# EAGLE design tx-qo100-v3 (EAGLE 9.6.2)
Assembly variants: LOW_PWR
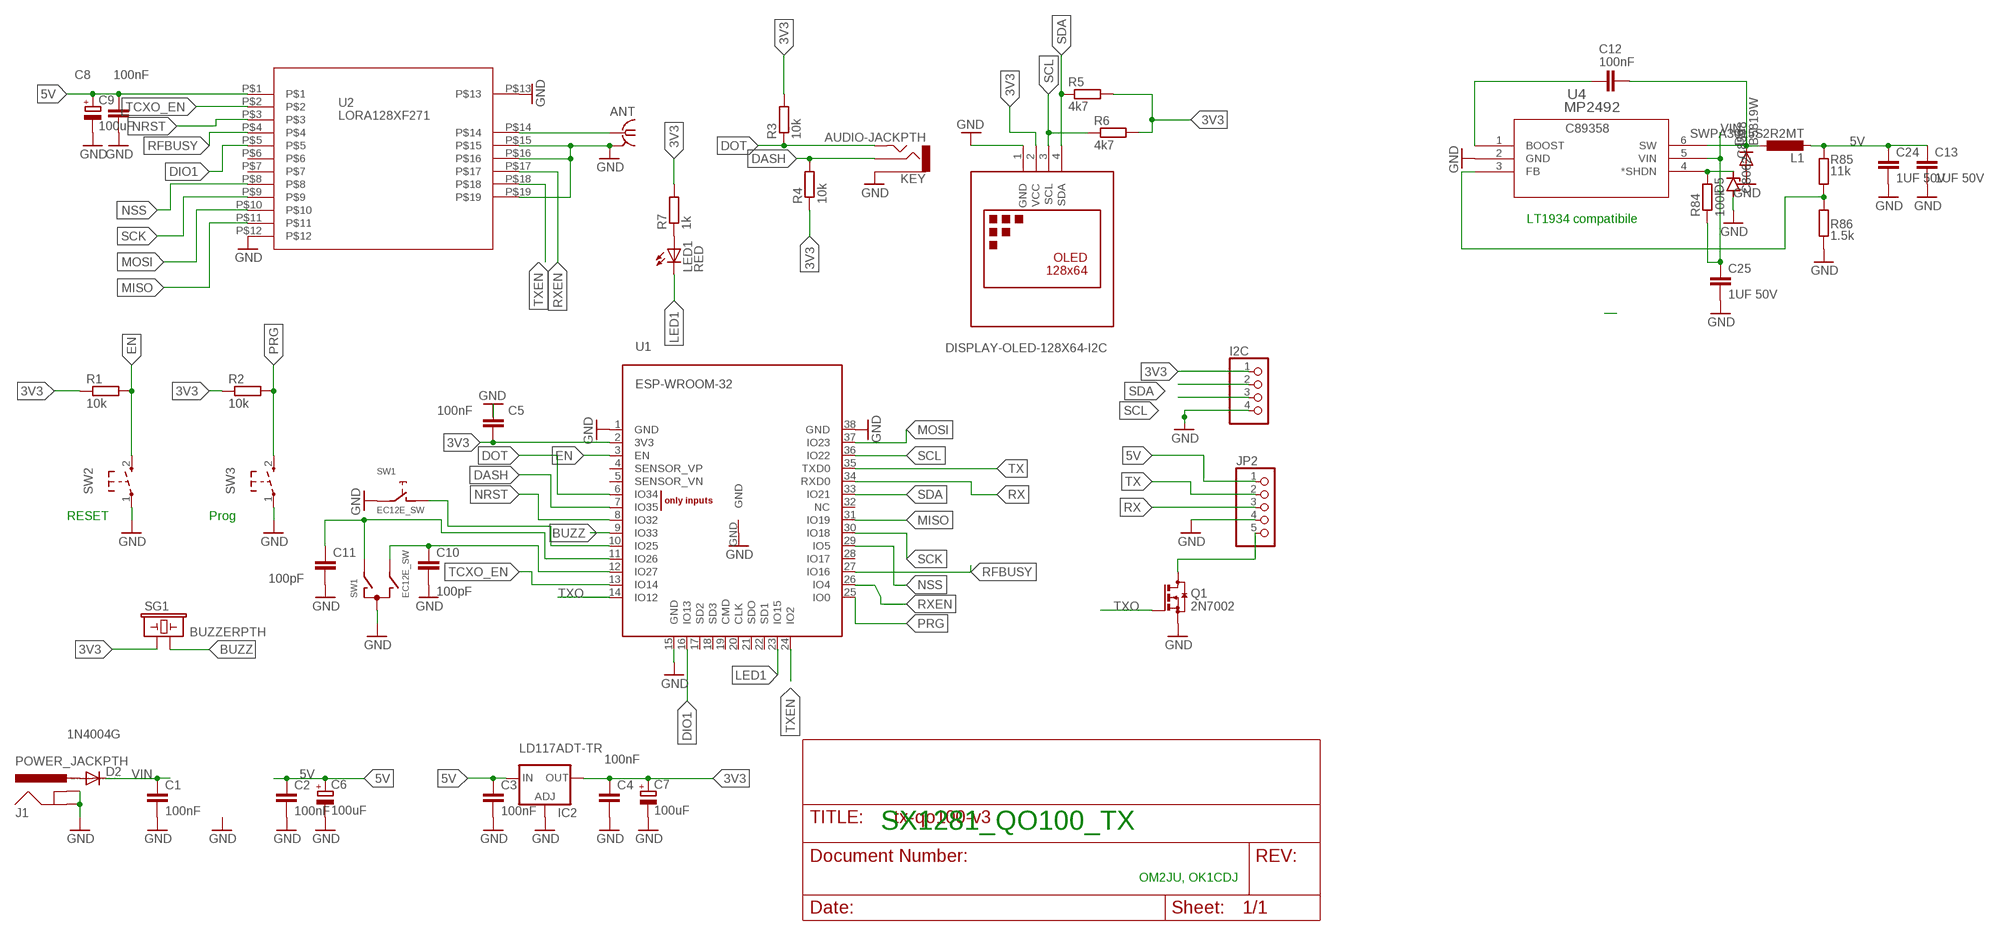
[diagram p0: schematic, sheet 1]

## Parts
ANT  SMA-142-0711-821/826  [J502-ND-142-0711-821/826]
C1  100nF  C-EUC0603  [C0603]
C2  100nF  C-EUC0603  [C0603]
C3  100nF  C-EUC0603  [C0603]
C4  100nF  C-EUC0603  [C0603]
C5  100nF  C-EUC0603  [C0603]
C6  100uF  CPOL-EUSMCB  [SMC_B]
C7  100uF  CPOL-EUSMCB  [SMC_B]
C8  100nF  C-EUC0603  [C0603]
C9  100uF  CPOL-EUSMCB  [SMC_B]
C10  100pF  C-EUC0603  [C0603]
C11  100pF  C-EUC0603  [C0603]
C12  100nF  C-EUC0603  [C0603]
C13  1UF 50V  C-EUC0603  [C0603]
C24  1UF 50V  C-EUC0603  [C0603]
C25  1UF 50V  C-EUC0603  [C0603]
D2  1N4004G  DIODE-DO-214AC  [DO-214AC]
D5  C8062  ZENER-DIODESOD80C  [SOD80C]
D6  B5819W  DIODE-SOD123  [SOD123]
I2C  PINHD-1X4  [1X04]
IC2  LD117ADT-TR  [DPACK]
J1  POWER_JACKPTH  [POWER_JACK_PTH]
JP2  PINHD-1X5/90  [1X05/90]
KEY  AUDIO-JACKPTH  [AUDIO-JACK]
L1  SWPA3015S2R2MT  L-EUL2825P  [L2825P]
LED1  RED  LEDCHIP-LED0805  [CHIP-LED0805]
Q1  2N7002  BSS123  [SOT23]
R1  10k  R-EU_R0603  [R0603]
R2  10k  R-EU_R0603  [R0603]
R3  10k  R-EU_R0603  [R0603]
R4  10k  R-EU_R0603  [R0603]
R5  4k7  R-EU_R0603  [R0603]
R6  4k7  R-EU_R0603  [R0603]
R7  1k  R-EU_R0603  [R0603]
R84  100k  R-EU_R0603  [R0603]
R85  11k  R-EU_R0603  [R0603]
R86  1.5k  R-EU_R0603  [R0603]
SG1  BUZZERPTH  [BUZZER-12MM]
SW1  EC12E_SW  [ALPS_EC12E_SW]
SW2  SW_TACT_2P-3X6  [SW_TACT_3X6]
SW3  SW_TACT_2P-3X6  [SW_TACT_3X6]
U1  ESP-WROOM-32  [ESP-WROOM-32]
U2  LORA128XF271  [LORA128XF27]
U4  MP2492  LT1934ES6TRMPBF  [SOT-6_S]  (not fitted in variant LOW_PWR)
U$1  DISPLAY-OLED-128X64-I2C  [DISPLAY-OLED-128X64-I2C]

## Nets
3V3: C4.1 C5.1 C7.+ I2C.1 IC2.4(OUT) R1.1 R2.1 R3.2 R4.1 R5.2 R6.2 R7.2 SG1.+ U1.2(3V3) U$1.2(VCC)
5V: C2.1 C3.1 C6.+ C8.1 C9.+ C13.1 C24.1 IC2.3(IN) JP2.1 L1.2 R85.1 U2.P$1
BST: C12.2 U4.1(BOOST)
BUZZ: SG1.- U1.9(IO33)
DASH: KEY.2 R4.2 U1.7(IO35)
DIO1: U1.16(IO13) U2.P$5
DOT: KEY.5 R3.1 U1.6(IO34)
EN: R1.2 SW2.2 U1.3(EN)
GND: ANT.G@1 ANT.G@2 ANT.G@3 ANT.G@4 C1.2 C2.2 C3.2 C4.2 C5.2 C6.- C7.- C8.2 C9.- C10.2 C11.2 C13.2 C24.2 C25.2 D5.A D6.A I2C.4 IC2.1(ADJ) J1.GND J1.GNDBREAK JP2.4 KEY.1 Q1.2(S) R86.1 SW1.C SW1.E SW2.1 SW3.1 U1.1(GND) U1.15(GND) U1.38(GND) U1.GND U2.P$12 U2.P$13 U2.P$15 U2.P$16 U2.P$19 U4.2(GND) U$1.1(GND)
IN: D2.A J1.PWR
LED1: LED1.C U1.23(IO15)
MISO: U1.31(IO19) U2.P$11
MOSI: U1.37(IO23) U2.P$10
N$1: ANT.1 U2.P$14
N$2: C10.1 SW1.B U1.12(IO27)
N$5: LED1.A R7.1
N$6: C11.1 SW1.A U1.11(IO26)
N$7: SW1.D U1.10(IO25)
N$8: JP2.5 Q1.3(D)
N$49: D5.C R84.2 U4.4(*SHDN)
N$50: R85.2 R86.2 U4.3(FB)
NRST: U1.8(IO32) U2.P$3
NSS: U1.29(IO5) U2.P$8
PRG: R2.2 SW3.2 U1.25(IO0)
RFBUSY: U1.27(IO16) U2.P$4
RX: JP2.3 U1.34(RXD0)
RXEN: U1.26(IO4) U2.P$17
SCK: U1.30(IO18) U2.P$9
SCL: I2C.3 R6.1 U1.36(IO22) U$1.3(SCL)
SDA: I2C.2 R5.1 U1.33(IO21) U$1.4(SDA)
SW: C12.1 D6.C L1.1 U4.6(SW)
TCXO_EN: U1.13(IO14) U2.P$2
TX: JP2.2 U1.35(TXD0)
TXEN: U1.24(IO2) U2.P$18
TXO: Q1.1(G) U1.14(IO12)
VIN: C1.1 C25.1 D2.C R84.1 U4.5(VIN)
Unconnected: SW1.GND1(G) SW1.GND2(G) U1.4(SENSOR_VP) U1.5(SENSOR_VN) U1.17(SD2) U1.18(SD3) U1.19(CMD) U1.20(CLK) U1.21(SDO) U1.22(SD1) U1.28(IO17) U1.32(NC) U2.P$6 U2.P$7

## Notes on the sheet
- LT1934 compatibile
- RESET | Prog
- SX1281_QO100_TX
- OM2JU, OK1CDJ

## Library data of the parts
ANT = con-coax:SMA-: SMA 50 Ohm End Launch Jack Receptacle - Round Contact Johnson Components Source: www.johnsoncomponents.com .. J502-ND.pdf; MF: JOHNSON COMPONENTS; MPN: 142-0711-821; OC_FARNELL: 1019328; OC_NEWARK: 16F3627
C1-C5 C8 C10-C12 = rcl:C-EU: CAPACITOR, European symbol; SPICEPREFIX: C
C6 C7 C9 = rcl:CPOL-EU: POLARIZED CAPACITOR, European symbol; LCSC_PART: C16133; ROT: 180; SPICEPREFIX: C
C13 C24 C25 = rcl:C-EU: CAPACITOR, European symbol; LCSC_PART: C15849; SPICEPREFIX: C
D2 = diode:DIODE-: DIODE; LCSC_PART: C433394
D5 = diode:ZENER-DIODE: Z-Diode; LCSC_PART: C8062
D6 = diode:DIODE-: DIODE; LCSC_PART: C8598
I2C = pinhead:PINHD-1X4: PIN HEADER
IC2 = v-reg:LD117A?*: Low drop fixed and adjustable positive voltage regulators 1 A Source: http://www.st.com/stonline/products/literature/ds/7194/ld1117axx.pdf; LCSC_PART: C358375; ROT: 90
J1 = #sparkfun:POWER_JACK: Power Jack This is the standard 5.5mm barrel jack for power. The PTH is the most common, proven, reliable, footprint. All others are experimental. The Slot footprint only works if the mill layer is transmitted to the PCB fab house so be warned. Spark Fun Electronics SKU : PRT-00119. Mating wall wart : TOL-00298 (and others)
JP2 = pinhead:PINHD-1X5: PIN HEADER
KEY = #sparkfun:AUDIO-JACK: 3.5mm Audio Jack Simple 3.5mm common PCB mount audio jack. SKU: PRT-08032
L1 = rcl:L-EU: INDUCTOR, European symbol; LCSC_PART: C43389; SPICEPREFIX: L
LED1 = adafruit:LED: LED OSRAM: - CHIPLED LG R971, LG N971, LY N971, LG Q971, LY Q971, LO R971, LY R971 LH N974, LH R974 LS Q976, LO Q976, LY Q976 LO Q996 - Hyper CHIPLED LW Q18S LB Q993, LB Q99A, LB R99A - SideLED LS A670, LO A670, LY A670, LG A670, LP A670 LB A673, LV A673, LT A673, LW A673 LH A674 LY A675 LS A676, LA A676, LO A676, LY A676, LW A676 LS A679, LY A679, LG A679 - Hyper Micro SIDELED® LS Y876, LA Y876, LO Y876, LY Y876 LT Y87S - SmartLED LW L88C, LW L88S LB L89C, LB L89S, LG L890 LS L89K, LO L89K, LY L89K LS L896, LA L896, LO L896, LY L896 - TOPLED LS T670, LO T670, LY T670, LG T670, LP T670 LSG T670, LSP T670, LSY T670, LOP T670, LYG T670 LG T671, LOG T671, LSG T671 LB T673, LV T673, LT T673, LW T673 LH T674 LS T676, LA T676, LO T676, LY T676, LB T676, LH T676, LSB T676, LW T676 LB T67C, LV T67C, LT T67C, LS T67K, LO T67K, LY T67K, LW E67C LS E67B, LA E67B, LO E67B, LY E67B, LB E67C, LV E67C, LT E67C LW T67C LS T679, LY T679, LG T679 LS T770, LO T770, LY T770, LG T770, LP T770 LB T773, LV T773, LT T773, LW T773 LH T774 LS E675, LA E675, LY E675, LS T675 LS T776, LA T776, LO T776, LY T776, LB T776 LHGB T686 LT T68C, LB T68C - Hyper Mini TOPLED® LB M676 - Mini TOPLED Santana® LG M470 LS M47K, LO M47K, LY M47K Source: http://www.osram.convergy.de/; LCSC_PART: C84256; ROT: 270
Q1 = transistor-small-signal:BSS123: N-CHANNEL MOS FET; LCSC_PART: C8545
R1-R7 R84-R86 = rcl:R-EU_: RESISTOR, European symbol; SPICEPREFIX: R
SG1 = #sparkfun:BUZZER: Buzzer 12mm Spark Fun Electronics SKU : Comp-Buzzer; LCSC_PART: C360607
SW1 = switch-alps:EC12E_SW: ALPS rotary Encoder EC12E series with switch; MPN: EC12E2424407; OC_FARNELL: 1520813; OC_NEWARK: 74M1068
SW2 SW3 = dp_devices:SW_TACT_2P; LCSC_PART: C520860
U1 = esp32:ESP-WROOM-32; ROT: 180
U2 = LORA:LORA128XF27
U4 = LT1934ES6TRMPBF:LT1934ES6TRMPBF; DESCRIPTION: LT1934 - Micropower Step-Down Switching Regulators in ThinSOT; DIGI-KEY_PART_NUMBER: LT1934ES6#TRMPBFCT-ND; DIGI-KEY_PURCHASE_URL: https://www.digikey.cz/product-detail/en/linear-technology-analog-devices/LT1934ES6-TRMPBF/LT1934ES6-TRMPBFCT-ND/1754246?utm_source=snapeda&utm_medium=aggregator&utm_campaign=symbol; LCSC_PART: C89358; MF: Linear Technology/Analog; MP: LT1934ES6#TRMPBF; PACKAGE: SOT-23-6 Linear Technology
U$1 = diy-modules:DISPLAY-OLED-128X64-I2C: 128x64 Dot Matrix OLED Module based on SSD1306 chip Variant with I2C interface More details available here: http://www.instructables.com/id/Monochrome-096-i2c-OLED-display-with-arduino-SSD13/ SSD1306 datasheet: https://cdn-shop.adafruit.com/datasheets/SSD1306.pdf Click here to find device on ebay.com <http://www.ebay.com/sch/oled+display+128x64+iic> Note: There are two variants: I2C and SPI. Search for the proper version.

## Board
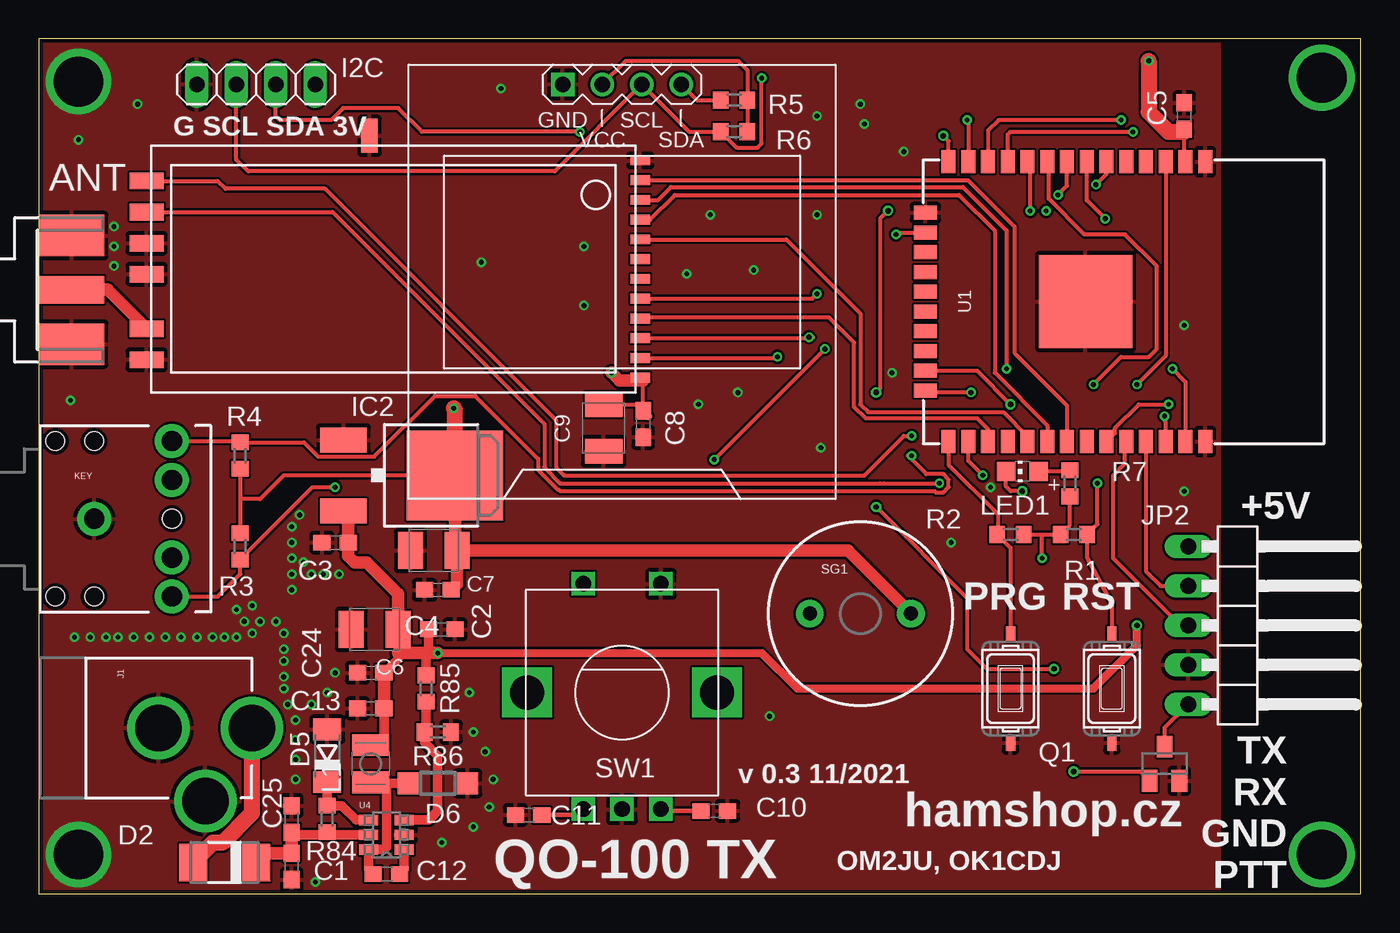
[diagram p1: board, top side]
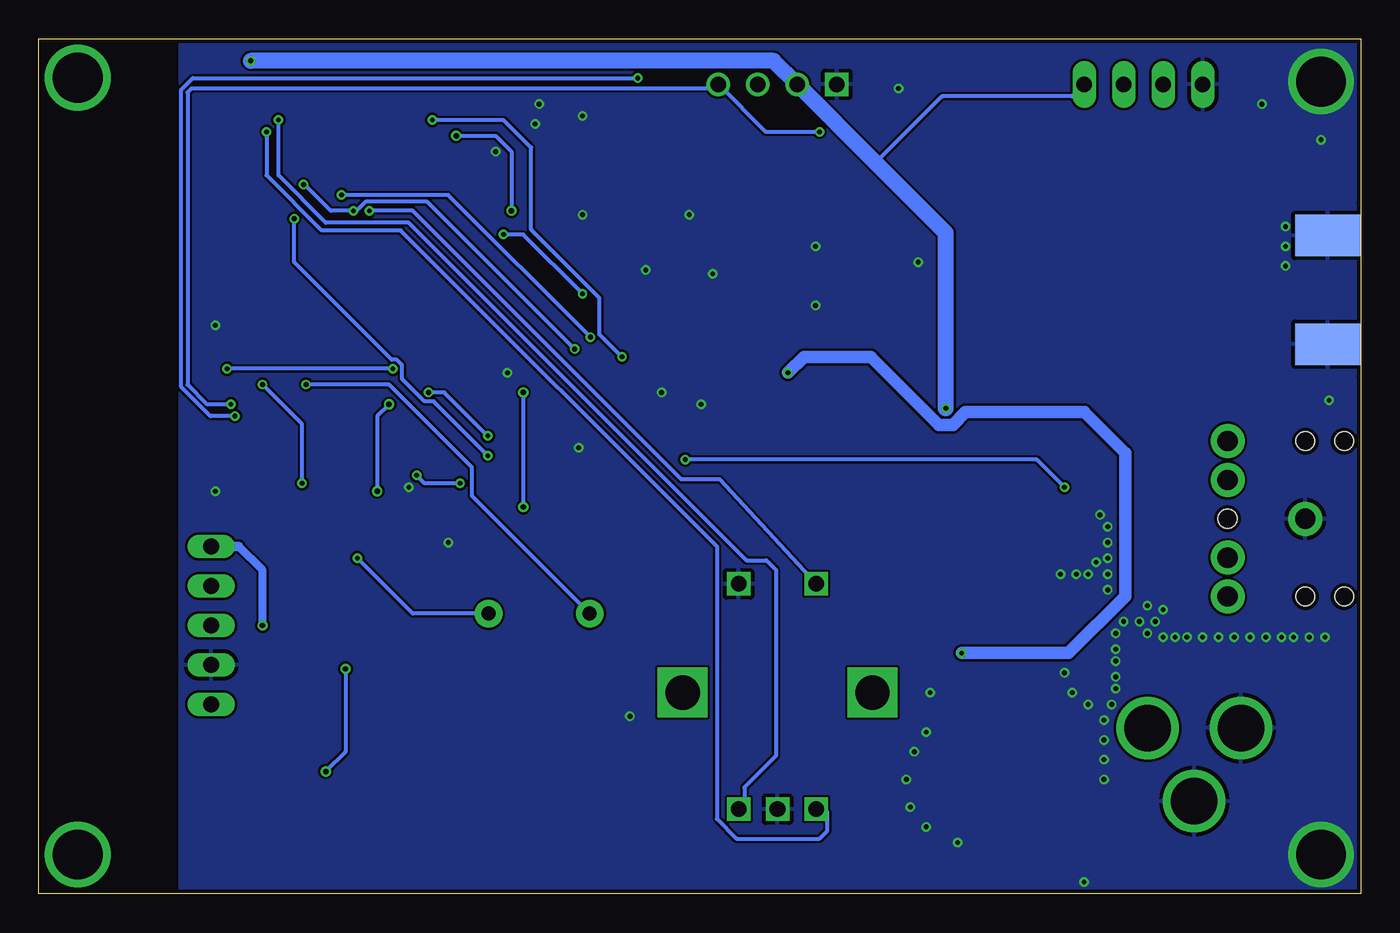
[diagram p2: board, bottom side, seen from below]

Size 85 x 55 mm. Coordinates in mm from the lower left corner, seen from the top.
Outline: 0,0 85,0 85,55 0,55 0,0
Copper layers (1*16): Top 0.035mm / dielectric 1.5mm / Bottom 0.035mm
Design rules "Fusion_eagle_rule_v1.1": minimum track width 6mil, minimum drill 12mil, track to track 6mil, track to pad 6mil, pad to pad 6mil, via to via 6mil, smd to smd 0mil, copper to edge 10mil, drill to drill 10mil, minimum pad ring 10mil, minimum via ring 6mil, stop-mask expansion 2mil, vias tented up to drill 100mil, thermal gap 10mil

### Footprints (pad centres in the part's own frame; a part is rotated, then mirrored left to right if it is on the bottom)
J502-ND-142-0711-821/826 = smd 4.191 x 1.778: 1 2.115,0 | smd 4.191 x 2.667: G@1 2.115,3.495; G@2 2.115,-3.495 | smd 4.191 x 2.667 bottom: G@3 2.115,3.495; G@4 2.115,-3.495
C0603 = smd 1.1 x 1: 1 -0.85,0; 2 0.85,0
SMC_B = smd 1.6 x 2.4: + -1.5,0; - 1.5,0
DO-214AC = smd 1.8 x 2.4: A 2.025,0; C -2.025,0
SOD80C = smd 1.4 x 1.8: A 1.7,0; C -1.7,0
SOD123 = smd 1.4 x 1.4: A 1.9,0; C -1.9,0
1X04 = drill 1.016 long: 1 -3.81,0; 2 -1.27,0; 3 1.27,0; 4 3.81,0
DPACK = smd 1.6 x 3: 1 -2.28,-4.8; 3 2.28,-4.8 | smd 5.8 x 6.2: 4 0,2.38
POWER_JACK_PTH = drill 2.997: GND 0,7.7; GNDBREAK 4.7,10.7; PWR 0,13.7
1X05/90 = drill 1.016 long: 1 -5.08,-3.81; 2 -2.54,-3.81; 3 0,-3.81; 4 2.54,-3.81; 5 5.08,-3.81
AUDIO-JACK = drill 1.3 pad 2.184: 1 0,0; 2 5,5; 3 5,2.5; 4 5,-2.5; 5 5,-5 | hole 1.2: 0,5; -2.5,5; -2.5,-5; 0,-5; 5,0
L2825P = smd 1.4 x 2.4: 1 -1.2,0; 2 1.2,0
CHIP-LED0805 = smd 1.2 x 1.2: A 0,-1.05; C 0,1.05
SOT23 = smd 1 x 1.4: 1 -0.95,-1.1; 2 0.95,-1.1; 3 0,1.1
R0603 = smd 1 x 1.1: 1 -0.85,0; 2 0.85,0
BUZZER-12MM = drill 0.9 pad 1.778: + 3.25,0; - -3.25,0
ALPS_EC12E_SW = drill 1 square: A -2.5,-7.5; B 2.5,-7.5; C 0,-7.5; D -2.5,7; E 2.5,7 | drill 2.2 square: GND1 -6.1,0; GND2 6.1,0
SW_TACT_3X6 = smd 1 x 0.6: 1 -3.5,0; 2 3.5,0
ESP-WROOM-32 = smd 0.9 x 1.5: 1 7.7,9; 2 6.43,9; 3 5.16,9; 4 3.89,9; 5 2.62,9; 6 1.35,9; 7 0.08,9; 8 -1.19,9; 9 -2.46,9; 10 -3.73,9; 11 -5,9; 12 -6.27,9; 13 -7.54,9; 14 -8.81,9; 25 -8.81,-9; 26 -7.54,-9; 27 -6.27,-9; 28 -5,-9; 29 -3.73,-9; 30 -2.46,-9; 31 -1.19,-9; 32 0.08,-9; 33 1.35,-9; 34 2.62,-9; 35 3.89,-9; 36 5.16,-9; 37 6.43,-9; 38 7.7,-9 | smd 1.5 x 0.9: 15 -10.3,5.715; 16 -10.3,4.445; 17 -10.3,3.175; 18 -10.3,1.905; 19 -10.3,0.635; 20 -10.3,-0.635; 21 -10.3,-1.905; 22 -10.3,-3.175; 23 -10.3,-4.445; 24 -10.3,-5.715 | smd 6 x 6: GND 0,0
LORA128XF27 = smd 0.635 x 1.27: P$1 0.953,-0.318; P$2 2.223,-0.318; P$3 3.493,-0.318; P$4 4.763,-0.318; P$5 6.032,-0.318; P$6 7.303,-0.318; P$7 8.572,-0.318; P$8 9.842,-0.318; P$9 11.113,-0.318; P$10 12.383,-0.318; P$11 13.652,-0.318; P$12 14.922,-0.318 | smd 1.067 x 2.184: P$13 2.1,31.433; P$14 4.1,31.433; P$15 7.6,31.433; P$16 9.6,31.433; P$17 11.6,31.433; P$18 13.6,31.433 | smd 2.184 x 1.067: P$19 16.51,17.093
SOT-6_S = smd 1.219 x 0.66: 1 -1.143,0.95; 2 -1.143,0; 3 -1.143,-0.95; 4 1.143,-0.95; 5 1.143,0; 6 1.143,0.95
DISPLAY-OLED-128X64-I2C = drill 1 square: 1 -3.81,12.7 | drill 1: 2 -1.27,12.7; 3 1.27,12.7; 4 3.81,12.7

### Placement (x,y rotation side)
ANT  0,38.86 0 top
C1  16.26,1.78 270 top
C2  25.91,17.02 0 top
C3  19.05,22.61 180 top
C4  25.65,19.56 180 top
C5  73.66,50.04 90 top
C6  21.59,17.02 180 top
C7  25.4,22.1 180 top
C8  38.86,30.23 270 top
C9  36.32,29.97 270 top
C10  43.43,5.33 0 top
C11  31.5,5.08 180 top
C12  22.35,1.27 0 top
C13  21.34,11.94 180 top
C24  21.34,14.22 180 top
C25  16.26,4.83 90 top
D2  11.94,2.03 180 top
D5  18.54,8.89 90 top
D6  25.65,7.11 0 top
I2C  13.97,52.07 180 top
IC2  24.38,26.92 270 top
J1  0,10.67 270 top
JP2  77.72,17.27 270 top
KEY  3.56,24.13 0 top
L1  21.34,8.38 90 top
LED1  63.25,27.18 90 top
Q1  72.39,8.38 0 top
R1  66.55,23.11 0 top
R2  62.48,23.11 180 top
R3  12.95,22.35 90 top
R4  12.95,28.19 90 top
R5  44.7,51.05 0 top
R6  44.7,49.02 0 top
R7  66.29,26.42 270 top
R84  18.54,4.83 90 top
R85  24.89,13.21 270 top
R86  25.65,10.41 180 top
SG1  52.83,18.03 0 top
SW1  37.5,12.95 0 top
SW2  69,13.21 90 top
SW3  62.48,13.21 90 top
U1  67.31,38.1 0 top
U2  38.35,32.26 90 top
U4  22.35,3.81 180 top
U$1  37.5,39.37 0 top

### Tracks (layer width: path | path; a pad name or v marks a point on that pad's centre or on a via)
3V3  (via drill 0.3)
  Top 0.254: R4.1 12.95,25.4 | 12.95,25.4 R3.2 | IC2.4 15.75,26.92 14.22,25.4 12.95,25.4 | U1.2 73.66,47.18 73.66,49.02 C5.1 | R2.1 64.52,23.11 | 64.52,23.11 R1.1 66.29,23.71 R7.2 | U$1.2 37.75,53.59 44.96,53.59 45.55,53 R5.2 R6.2 | v64.52,21.59 64.52,23.11
  Top 0.813: IC2.4 26.76,22.23 C7.+ | C7.+ 26.9,19.95 C4.1 | C7.+ 52.02,22.1 SG1.+
  Top 1.016: IC2.4 26.76,31.15 v26.67,31.24 | v71.37,53.59 71.37,50.29 72.64,49.02 73.66,49.02
  Bottom 0.254: SG1.+ 60.96,18.03 v64.52,21.59 | I2C.1 18.54,51.31 26.92,51.31 31.2,47.04
  Bottom 1.016: v26.67,31.24 26.67,42.51 31.2,47.04 U$1.2 37.75,53.59 v71.37,53.59
5V  (via drill 0.3, 0.35)
  Top 0.254: C9.+ 38.47,31.47 C8.1 38.86,33.02 U2.P$1
  Top 0.508: C8.1 39.2,30.73 | v25.65,15.49 46.48,15.49 48.77,13.21 67.82,13.21 70.61,16 v70.61,17.27
  Top 0.61: L1.2 21.59,9.58 22.19,10.18 C13.1 | C6.+ 23.09,15.49 | 23.09,15.49 23.09,15.13 C24.1 | R85.1 24.89,15.49 25.06,15.66 C2.1 | 23.11,15.49 23.09,15.49
  Top 0.813: C6.+ 23.11,17.02 23.11,19.3 21.08,21.34 20.32,21.34 19.9,21.76 C3.1 19.9,24.33 IC2.3 | v36.83,33.53 37.34,33.02 38.86,33.02 | 23.11,15.49 24.89,15.49 v25.65,15.49 | C24.1 C13.1
  Bottom 0.508: v70.61,17.27 70.61,20.83 72.14,22.35
  Bottom 0.61: 72.14,22.35 JP2.1
  Bottom 0.813: v25.65,15.49 18.8,15.49 15.14,19.14 15.14,28.35 17.78,30.99 25.41,30.99 26.23,30.18 27.11,30.18 31.48,34.54 35.81,34.54 v36.83,33.53
BST
  Top 0.61: C12.2 23.5,1.56 U4.1
BUZZ  (via drill 0.3)
  Top 0.254: v67.82,32.77 69.6,34.54 71.37,34.54 71.88,35.05 71.88,40.39 69.85,42.42 67.25,42.42 64.95,44.72 64.95,47 U1.9
  Bottom 0.254: SG1.- 57.15,25.6 57.15,27.43 62.48,32.77 v67.82,32.77
DASH  (via drill 0.3)
  Top 0.254: KEY.2 12.87,29.13 R4.2 17.05,29.04 17.97,28.12 21.57,28.12 25.47,32.03 28.05,32.03 32.11,27.98 32.11,27.26 33.36,26.01 33.43,26.01 33.53,25.91 57.59,25.91 57.67,25.83 58.15,25.83 58.5,26.17 58.5,26.66 58.15,27 57.07,27 55.88,28.19 v56.13,28.19 | v68.58,43.43 67.39,44.62 U1.7
  Bottom 0.254: v68.58,43.43 68.58,40.64 62.31,34.37 61.99,34.37 61.65,34.02 61.65,33.13 60.19,31.67 59.61,31.67 v56.13,28.19
DIO1  (via drill 0.3)
  Top 0.254: U2.P$5 49.72,38.29 v50.04,38.61 | v55.12,42.42 55.24,42.55 U1.16
  Bottom 0.254: v50.04,38.61 53.85,42.42 v55.12,42.42
DOT  (via drill 0.3)
  Top 0.254: KEY.5 11.51,19.13 12.95,20.57 R3.1 17.61,26.16 v19.05,26.16 | v43.43,27.94 v50.55,35.05 | v67.97,45.63 68.66,46.31 U1.6
  Bottom 0.254: v19.05,26.16 20.83,27.94 v43.43,27.94 | v50.55,35.05 60.02,44.53 64,44.53 64.58,43.94 v64.77,43.94 66.23,43.94 67.91,45.63 v67.97,45.63
EN  (via drill 0.3)
  Top 0.254: SW2.2 69,18.68 67.4,21.68 R1.2 68.07,23.79 v68.07,26.42 | U1.3 72.47,34.62 v70.61,32.77
  Bottom 0.254: v68.07,26.42 68.07,30.23 v70.61,32.77
GND  (via drill 0.3, 3.2)
  other vias: 2.54,52.25 2.54,2.54 2.29,16.51 4.83,40.39 4.83,41.66 4.83,42.93 54.86,33.53 50.29,28.7 42.42,31.5 44.96,32.26 28.45,40.64 16.76,24.38 12.7,16.51 73.66,36.58 73.66,25.91 61.21,26.16 58.67,22.61 46.99,11.43 28.7,9.14 27.69,12.95 2.03,31.75 2.54,48.51 6.35,50.8 29.72,51.82 35.05,37.85 35.05,41.66 43.18,43.69 50.04,43.69 41.66,39.88 45.97,40.13 53.09,49.53 50.04,50.04 52.83,50.8 55.63,47.75 16.26,19.56 15.75,16.76 15.75,15.75 15.75,14.99 15.75,13.97 15.24,17.53 15.75,13.21 16.26,20.57 16.26,22.61 19.3,20.57 18.29,20.57 17.53,20.57 17.02,21.34 16.26,21.59 16.51,7.37 17.78,0.76 18.54,12.95 17.53,12.19 27.94,10.41 19.05,14.22 29.21,7.37 16.51,8.64 16.51,11.18 16,12.19 25.91,3.3 16.51,9.91 28.96,5.59 27.94,4.32 16.26,23.62 3.3,16.51 4.32,16.51 5.08,16.51 6.1,16.51 7.11,16.51 8.13,16.51 9.14,16.51 10.16,16.51 11.18,16.51 11.94,16.51 13.72,16.76 14.22,17.53 13.72,18.54 12.7,18.29 13.21,17.53
  pour Bottom: 0,55.88 75.95,55.88 75.95,0 0,0
  pour Top: 0.25,55.12 75.95,55.12 75.95,0 0.25,0
IN
  Top 1.016: D2.A 11.18,3.3 11.8,3.3 13.7,5.2 J1.PWR
LED1  (via drill 0.35)
  Top 0.254: U1.23 60.33,33.66 v62.48,31.5 | v63.25,25.91 62.48,25.91 62.2,26.2 LED1.C
  Bottom 0.254: v62.48,31.5 63.25,30.73 v63.25,25.91
MISO
  Top 0.254: U2.P$11 59.75,45.91 62.74,42.93 62.74,34.8 66.12,31.42 U1.31
MOSI  (via drill 0.3)
  Top 0.254: U2.P$10 39.81,44.64 40.64,45.47 59.44,45.47 62.23,42.67 v62.23,33.78 | v72.9,33.78 73.74,32.94 U1.37
  Bottom 0.254: v62.23,33.78 v72.9,33.78
N$1
  Top 0.813: ANT.1 4.42,38.86 U2.P$14
N$2  (via drill 0.3)
  Top 0.254: v69.6,49.78 61.72,49.78 61.04,49.1 U1.12
  Top 0.305: C10.1 40.12,5.33 SW1.B
  Bottom 0.254: v69.6,49.78 69.6,46.23 66.55,43.18 61.21,43.18 39.49,21.46 38.22,21.46 37.59,20.83 37.59,8.89 39.62,6.86 39.62,5.59 SW1.B
N$3  (via drill 3.2)
  other vias: 82.5,52.5
N$4  (via drill 3.2)
  other vias: 82.5,2.54
N$5
  Top 0.254: R7.1 66.21,27.18 LED1.A
N$6  (via drill 0.3)
  Top 0.254: U1.11 62.31,48.85 62.48,49.02 v70.36,49.02
  Top 0.305: C11.1 34.63,5.08 SW1.A
  Bottom 0.254: v70.36,49.02 70.36,46.23 66.8,42.67 61.72,42.67 41.4,22.35 41.4,4.83 40.13,3.56 34.8,3.56 34.29,4.06 34.29,5.25 SW1.A
N$7  (via drill 0.3)
  Top 0.254: v63.75,43.94 63.75,46.93 U1.10
  Bottom 0.254: SW1.D 41.21,26.67 43.69,26.67 60.96,43.94 v63.75,43.94
N$8
  Top 0.254: Q1.3 72.39,10.67 JP2.5
N$49
  Top 0.61: D5.C R84.2 19.47,5.68 20.39,4.76 U4.4
N$50
  Top 0.61: R85.2 24.89,10.5 R86.2 24.8,9.74 25.65,8.89 25.65,5.33 25.08,4.76 U4.3
NRST  (via drill 0.3)
  Top 0.254: U2.P$3 49.72,35.75 49.78,35.81 v49.53,35.81 | v65.53,44.96 66.12,45.55 U1.8
  Bottom 0.254: v49.53,35.81 58.67,44.96 v65.53,44.96
NSS
  Top 0.254: U2.P$8 48.07,42.1 52.83,37.34 52.83,31.5 53.34,30.99 62.02,30.99 63.58,29.43 U1.29
PRG
  Top 0.254: R2.2 61.68,23.07 | 61.68,23.07 62.48,22.26 SW3.2 | U1.25 58.5,27.61 61.4,24.7 61.56,24.53 61.57,24.53 61.68,24.43 61.68,24.38 61.68,23.07
RFBUSY
  Top 0.254: U1.27 61.04,29.89 60.35,30.58 53.17,30.58 52.43,31.33 52.43,35.46 50.8,37.08 38.73,37.08 U2.P$4
RX
  Top 0.254: U1.34 69.85,29.02 69.85,27.69 69.09,26.92 69.09,21.59 73.41,17.27 JP2.3
RXEN  (via drill 0.3)
  Top 0.254: U2.P$17 18.88,43.86 32.51,30.23 32.51,27.43 33.53,26.42 54.1,26.42 54.36,26.42 v57.91,26.42 | v60.71,26.92 59.77,27.86 U1.26
  Bottom 0.254: v57.91,26.42 60.2,26.42 v60.71,26.92
SCK
  Top 0.254: U2.P$9 39.31,43.37 40.89,44.96 59.18,44.96 61.47,42.67 61.47,33.53 64.85,30.15 U1.30
SCL  (via drill 0.3)
  Top 0.254: U1.36 72.47,30.4 72.39,30.48 v72.39,30.73 | v46.48,52.48 46.48,48.26 46.23,48.01 44.87,48.01 R6.1 41.82,49.02 U$1.3 33.18,46.48 13.46,46.48 12.7,47.24 I2C.3
  Bottom 0.254: v72.39,30.73 73.98,30.73 75.84,32.6 75.84,51.73 75.1,52.48 v46.48,52.48
SDA  (via drill 0.3)
  Top 0.254: U$1.4 42.33,51.05 R5.1 | U1.33 69.2,29.64 69.2,29.97 70.73,31.5 v72.64,31.5 | v34.8,49.02 24.64,49.02 23.11,50.55 19.56,50.55 18.8,49.78 15.49,49.78 15.24,50.04 I2C.2
  Bottom 0.254: v72.64,31.5 74.17,31.5 75.44,32.77 75.44,51.56 75.18,51.82 41.56,51.82 U$1.4 38.26,49.02 v34.8,49.02
SW
  Top 0.61: D6.C 21.41,7.11 L1.1 22.28,7.18 22.35,7.11 22.35,3.05 22.16,2.86 U4.6 21.21,1.56 C12.1
TCXO_EN  (via drill 0.3)
  Top 0.254: U2.P$2 47.43,34.48 v47.5,34.54 | v59.69,49.78 59.77,49.7 U1.13
  Bottom 0.254: v47.5,34.54 48.95,35.99 48.95,38.34 53.34,42.74 53.34,48.01 55.12,49.78 v59.69,49.78
TX
  Top 0.254: JP2.2 72.14,19.81 71.2,20.75 U1.35
TXEN  (via drill 0.3)
  Top 0.254: U2.P$18 11.49,45.86 12,45.35 18.4,45.35 33.27,30.48 33.27,27.43 33.78,26.92 53.09,26.92 55.63,29.46 v56.13,29.46 | v59.94,32.26 57.14,32.26 U1.24
  Bottom 0.254: v56.13,29.46 58.93,32.26 v59.94,32.26
TXO  (via drill 0.35)
  Top 0.254: U1.14 58.5,48.43 v58.17,48.77 | v54.61,43.94 54.1,43.43 54.1,32.51 v53.85,32.26 | v53.85,24.89 59.69,19.05 59.69,15.75 60.96,14.48 v65.28,14.48 | v66.55,7.87 70.85,7.87 Q1.1
  Bottom 0.254: v54.61,43.94 54.61,47.75 55.63,48.77 v58.17,48.77 | v53.85,32.26 v53.85,24.89 | v65.28,14.48 65.28,9.14 v66.55,7.87
VIN
  Top 0.61: C25.1 16.42,3.81 18.54,3.81 R84.1 18.71,3.81 U4.5
  Top 0.813: D2.C 14.56,2.63 C1.1 C25.1

### Text on the board
tNames: G SCL SDA 3V | +5V | PRG | RST | TX / RX / GND / PTT | v 0.3 11/2021 | hamshop.cz | OM2JU, OK1CDJ | QO-100 TX